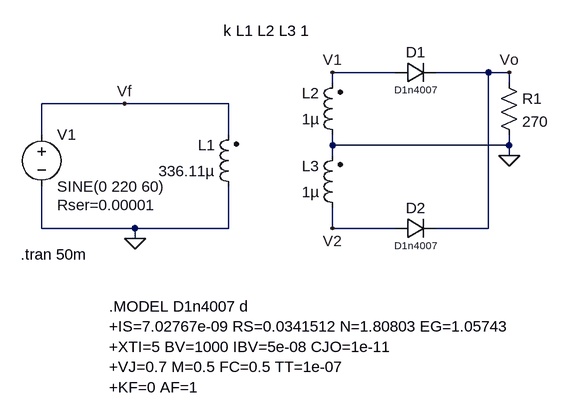
[diagram p0: schematic Ondacompleta com tap_s capacitor.asc]
Ondacompleta com tap_s capacitor.asc, the LTspice schematic file:
Version 4
SHEET 1 1676 680
WIRE 592 32 496 32
WIRE 736 32 656 32
WIRE 768 32 736 32
WIRE 496 48 496 32
WIRE 768 48 768 32
WIRE 176 80 48 80
WIRE 336 80 176 80
WIRE 48 128 48 80
WIRE 336 128 336 80
WIRE 496 144 496 128
WIRE 768 144 768 128
WIRE 768 144 496 144
WIRE 496 160 496 144
WIRE 768 160 768 144
WIRE 48 272 48 208
WIRE 192 272 48 272
WIRE 336 272 336 208
WIRE 336 272 192 272
WIRE 496 272 496 240
WIRE 592 272 496 272
WIRE 736 272 736 32
WIRE 736 272 656 272
WIRE 192 288 192 272
FLAG 192 288 0
FLAG 176 80 Vf
FLAG 768 32 Vo
FLAG 768 160 0
FLAG 496 32 V1
FLAG 496 272 V2
SYMBOL voltage 48 112 R0
WINDOW 123 0 0 Left 0
WINDOW 39 24 124 Left 2
SYMATTR SpiceLine Rser=0.00001
SYMATTR InstName V1
SYMATTR Value SINE(0 220 60)
SYMBOL ind2 352 224 R180
WINDOW 0 36 80 Left 2
WINDOW 3 36 40 Left 2
SYMATTR InstName L1
SYMATTR Value 336.11µ
SYMATTR Type ind
SYMBOL ind2 512 144 R180
WINDOW 0 36 80 Left 2
WINDOW 3 36 40 Left 2
SYMATTR InstName L2
SYMATTR Value 1µ
SYMATTR Type ind
SYMBOL res 752 32 R0
SYMATTR InstName R1
SYMATTR Value 270
SYMBOL diode 592 48 R270
WINDOW 0 32 32 VTop 2
WINDOW 3 0 32 VBottom 1
SYMATTR InstName D1
SYMATTR Value D1n4007
SYMBOL ind2 512 256 R180
WINDOW 0 36 80 Left 2
WINDOW 3 36 40 Left 2
SYMATTR InstName L3
SYMATTR Value 1µ
SYMATTR Type ind
SYMBOL diode 592 288 R270
WINDOW 0 32 32 VTop 2
WINDOW 3 0 32 VBottom 1
SYMATTR InstName D2
SYMATTR Value D1n4007
TEXT 328 -32 Left 2 !k L1 L2 L3 1
TEXT 16 312 Left 2 !.tran 50m
TEXT 152 392 Left 2 !.MODEL D1n4007 d\n+IS=7.02767e-09 RS=0.0341512 N=1.80803 EG=1.05743\n+XTI=5 BV=1000 IBV=5e-08 CJO=1e-11\n+VJ=0.7 M=0.5 FC=0.5 TT=1e-07\n+KF=0 AF=1

The netlist it stands for:
* Ondacompleta com tap_s capacitor.asc
V1 Vf 0 SINE(0 220 60) Rser=0.00001
L1 0 Vf 336.11µ
L2 0 V1 1µ
R1 Vo 0 270
D1 V1 Vo D1n4007
L3 V2 0 1µ
D2 V2 Vo D1n4007
.model D D
.lib standard.dio
k L1 L2 L3 1
.tran 50m
.MODEL D1n4007 d
+IS=7.02767e-09 RS=0.0341512 N=1.80803 EG=1.05743
+XTI=5 BV=1000 IBV=5e-08 CJO=1e-11
+VJ=0.7 M=0.5 FC=0.5 TT=1e-07
+KF=0 AF=1
.backanno
.end